# Altium schematic sheet WS2812_MATRIX_9.SchDoc
size A4
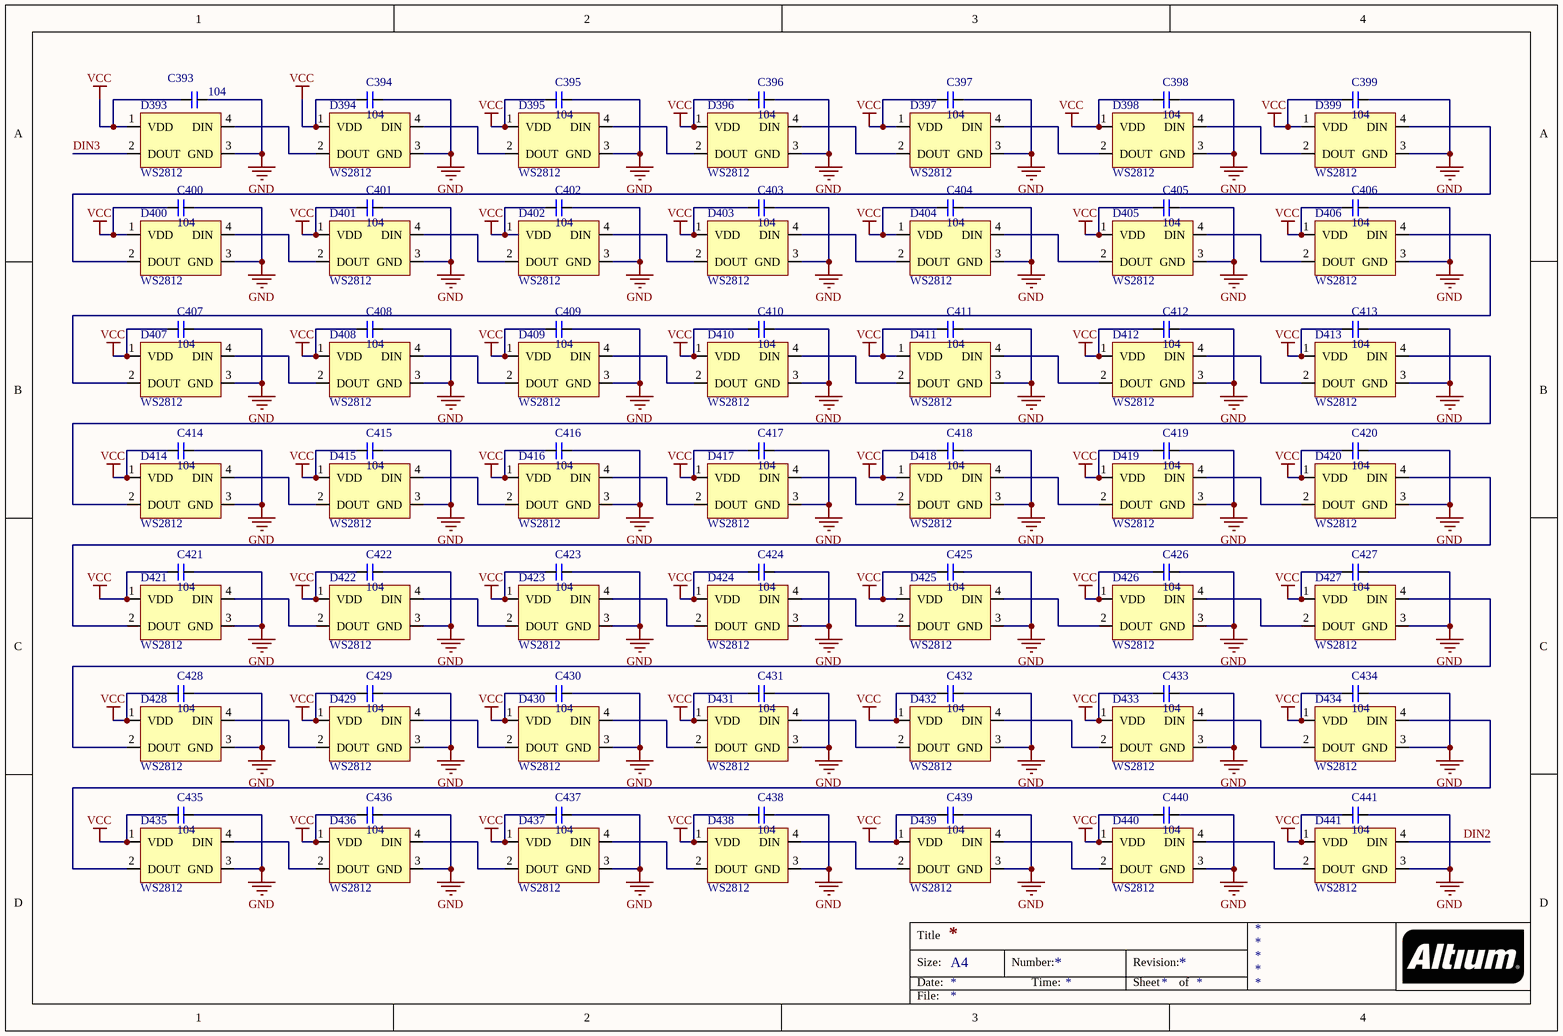
[diagram p0: WS2812_MATRIX_9.SchDoc]

## Parts
C393  104  [C0805]
C394  104  [C0805]
C395  104  [C0805]
C396  104  [C0805]
C397  104  [C0805]
C398  104  [C0805]
C399  104  [C0805]
C400  104  [C0805]
C401  104  [C0805]
C402  104  [C0805]
C403  104  [C0805]
C404  104  [C0805]
C405  104  [C0805]
C406  104  [C0805]
C407  104  [C0805]
C408  104  [C0805]
C409  104  [C0805]
C410  104  [C0805]
C411  104  [C0805]
C412  104  [C0805]
C413  104  [C0805]
C414  104  [C0805]
C415  104  [C0805]
C416  104  [C0805]
C417  104  [C0805]
C418  104  [C0805]
C419  104  [C0805]
C420  104  [C0805]
C421  104  [C0805]
C422  104  [C0805]
C423  104  [C0805]
C424  104  [C0805]
C425  104  [C0805]
C426  104  [C0805]
C427  104  [C0805]
C428  104  [C0805]
C429  104  [C0805]
C430  104  [C0805]
C431  104  [C0805]
C432  104  [C0805]
C433  104  [C0805]
C434  104  [C0805]
C435  104  [C0805]
C436  104  [C0805]
C437  104  [C0805]
C438  104  [C0805]
C439  104  [C0805]
C440  104  [C0805]
C441  104  [C0805]
D393  WS2812  [WS2812_3528]
D394  WS2812  [WS2812_3528]
D395  WS2812  [WS2812_3528]
D396  WS2812  [WS2812_3528]
D397  WS2812  [WS2812_3528]
D398  WS2812  [WS2812_3528]
D399  WS2812  [WS2812_3528]
D400  WS2812  [WS2812_3528]
D401  WS2812  [WS2812_3528]
D402  WS2812  [WS2812_3528]
D403  WS2812  [WS2812_3528]
D404  WS2812  [WS2812_3528]
D405  WS2812  [WS2812_3528]
D406  WS2812  [WS2812_3528]
D407  WS2812  [WS2812_3528]
D408  WS2812  [WS2812_3528]
D409  WS2812  [WS2812_3528]
D410  WS2812  [WS2812_3528]
D411  WS2812  [WS2812_3528]
D412  WS2812  [WS2812_3528]
D413  WS2812  [WS2812_3528]
D414  WS2812  [WS2812_3528]
D415  WS2812  [WS2812_3528]
D416  WS2812  [WS2812_3528]
D417  WS2812  [WS2812_3528]
D418  WS2812  [WS2812_3528]
D419  WS2812  [WS2812_3528]
D420  WS2812  [WS2812_3528]
D421  WS2812  [WS2812_3528]
D422  WS2812  [WS2812_3528]
D423  WS2812  [WS2812_3528]
D424  WS2812  [WS2812_3528]
D425  WS2812  [WS2812_3528]
D426  WS2812  [WS2812_3528]
D427  WS2812  [WS2812_3528]
D428  WS2812  [WS2812_3528]
D429  WS2812  [WS2812_3528]
D430  WS2812  [WS2812_3528]
D431  WS2812  [WS2812_3528]
D432  WS2812  [WS2812_3528]
D433  WS2812  [WS2812_3528]
D434  WS2812  [WS2812_3528]
D435  WS2812  [WS2812_3528]
D436  WS2812  [WS2812_3528]
D437  WS2812  [WS2812_3528]
D438  WS2812  [WS2812_3528]
D439  WS2812  [WS2812_3528]
D440  WS2812  [WS2812_3528]
D441  WS2812  [WS2812_3528]

## Nets
GND: C393.2 C394.1 C395.1 C396.1 C397.1 C398.1 C399.1 C400.1 C401.1 C402.1 C403.1 C404.1 C405.1 C406.1 C407.1 C408.1 C409.1 C410.1 C411.1 C412.1 C413.1 C414.1 C415.1 C416.1 C417.1 C418.1 C419.1 C420.1 C421.1 C422.1 C423.1 C424.1 C425.1 C426.1 C427.1 C428.1 C429.1 C430.1 C431.1 C432.1 C433.1 C434.1 C435.1 C436.1 C437.1 C438.1 C439.1 C440.1 C441.1 D393.3(GND) D394.3(GND) D395.3(GND) D396.3(GND) D397.3(GND) D398.3(GND) D399.3(GND) D400.3(GND) D401.3(GND) D402.3(GND) D403.3(GND) D404.3(GND) D405.3(GND) D406.3(GND) D407.3(GND) D408.3(GND) D409.3(GND) D410.3(GND) D411.3(GND) D412.3(GND) D413.3(GND) D414.3(GND) D415.3(GND) D416.3(GND) D417.3(GND) D418.3(GND) D419.3(GND) D420.3(GND) D421.3(GND) D422.3(GND) D423.3(GND) D424.3(GND) D425.3(GND) D426.3(GND) D427.3(GND) D428.3(GND) D429.3(GND) D430.3(GND) D431.3(GND) D432.3(GND) D433.3(GND) D434.3(GND) D435.3(GND) D436.3(GND) D437.3(GND) D438.3(GND) D439.3(GND) D440.3(GND) D441.3(GND)
VCC: C393.1 C394.2 C395.2 C396.2 C397.2 C398.2 C399.2 C400.2 C401.2 C402.2 C403.2 C404.2 C405.2 C406.2 C407.2 C408.2 C409.2 C410.2 C411.2 C412.2 C413.2 C414.2 C415.2 C416.2 C417.2 C418.2 C419.2 C420.2 C421.2 C422.2 C423.2 C424.2 C425.2 C426.2 C427.2 C428.2 C429.2 C430.2 C431.2 C432.2 C433.2 C434.2 C435.2 C436.2 C437.2 C438.2 C439.2 C440.2 C441.2 D393.1(VDD) D394.1(VDD) D395.1(VDD) D396.1(VDD) D397.1(VDD) D398.1(VDD) D399.1(VDD) D400.1(VDD) D401.1(VDD) D402.1(VDD) D403.1(VDD) D404.1(VDD) D405.1(VDD) D406.1(VDD) D407.1(VDD) D408.1(VDD) D409.1(VDD) D410.1(VDD) D411.1(VDD) D412.1(VDD) D413.1(VDD) D414.1(VDD) D415.1(VDD) D416.1(VDD) D417.1(VDD) D418.1(VDD) D419.1(VDD) D420.1(VDD) D421.1(VDD) D422.1(VDD) D423.1(VDD) D424.1(VDD) D425.1(VDD) D426.1(VDD) D427.1(VDD) D428.1(VDD) D429.1(VDD) D430.1(VDD) D431.1(VDD) D432.1(VDD) D433.1(VDD) D434.1(VDD) D435.1(VDD) D436.1(VDD) D437.1(VDD) D438.1(VDD) D439.1(VDD) D440.1(VDD) D441.1(VDD)
DIN2: D441.4(DIN)
DIN3: D393.2(DOUT)
NetD393_4: D393.4(DIN) D394.2(DOUT)
NetD394_4: D394.4(DIN) D395.2(DOUT)
NetD395_4: D395.4(DIN) D396.2(DOUT)
NetD396_4: D396.4(DIN) D397.2(DOUT)
NetD397_4: D397.4(DIN) D398.2(DOUT)
NetD398_4: D398.4(DIN) D399.2(DOUT)
NetD399_4: D399.4(DIN) D400.2(DOUT)
NetD400_4: D400.4(DIN) D401.2(DOUT)
NetD401_4: D401.4(DIN) D402.2(DOUT)
NetD402_4: D402.4(DIN) D403.2(DOUT)
NetD403_4: D403.4(DIN) D404.2(DOUT)
NetD404_4: D404.4(DIN) D405.2(DOUT)
NetD405_4: D405.4(DIN) D406.2(DOUT)
NetD406_4: D406.4(DIN) D407.2(DOUT)
NetD407_4: D407.4(DIN) D408.2(DOUT)
NetD408_4: D408.4(DIN) D409.2(DOUT)
NetD409_4: D409.4(DIN) D410.2(DOUT)
NetD410_4: D410.4(DIN) D411.2(DOUT)
NetD411_4: D411.4(DIN) D412.2(DOUT)
NetD412_4: D412.4(DIN) D413.2(DOUT)
NetD413_4: D413.4(DIN) D414.2(DOUT)
NetD414_4: D414.4(DIN) D415.2(DOUT)
NetD415_4: D415.4(DIN) D416.2(DOUT)
NetD416_4: D416.4(DIN) D417.2(DOUT)
NetD417_4: D417.4(DIN) D418.2(DOUT)
NetD418_4: D418.4(DIN) D419.2(DOUT)
NetD419_4: D419.4(DIN) D420.2(DOUT)
NetD420_4: D420.4(DIN) D421.2(DOUT)
NetD421_4: D421.4(DIN) D422.2(DOUT)
NetD422_4: D422.4(DIN) D423.2(DOUT)
NetD423_4: D423.4(DIN) D424.2(DOUT)
NetD424_4: D424.4(DIN) D425.2(DOUT)
NetD425_4: D425.4(DIN) D426.2(DOUT)
NetD426_4: D426.4(DIN) D427.2(DOUT)
NetD427_4: D427.4(DIN) D428.2(DOUT)
NetD428_4: D428.4(DIN) D429.2(DOUT)
NetD429_4: D429.4(DIN) D430.2(DOUT)
NetD430_4: D430.4(DIN) D431.2(DOUT)
NetD431_4: D431.4(DIN) D432.2(DOUT)
NetD432_4: D432.4(DIN) D433.2(DOUT)
NetD433_4: D433.4(DIN) D434.2(DOUT)
NetD434_4: D434.4(DIN) D435.2(DOUT)
NetD435_4: D435.4(DIN) D436.2(DOUT)
NetD436_4: D436.4(DIN) D437.2(DOUT)
NetD437_4: D437.4(DIN) D438.2(DOUT)
NetD438_4: D438.4(DIN) D439.2(DOUT)
NetD439_4: D439.4(DIN) D440.2(DOUT)
NetD440_4: D440.4(DIN) D441.2(DOUT)

## Notes on the sheet
- Title
- Size:
- Date:
- A4
- Number:
- Time:
- Revision:
- Sheet
- of
- File:

## Library data of the parts
C393-C441 = CAP